# Altium schematic sheet Power_Supply.SchDoc
size A4; DocumentNumber: 1; SheetNumber: 1; SheetTotal: 3
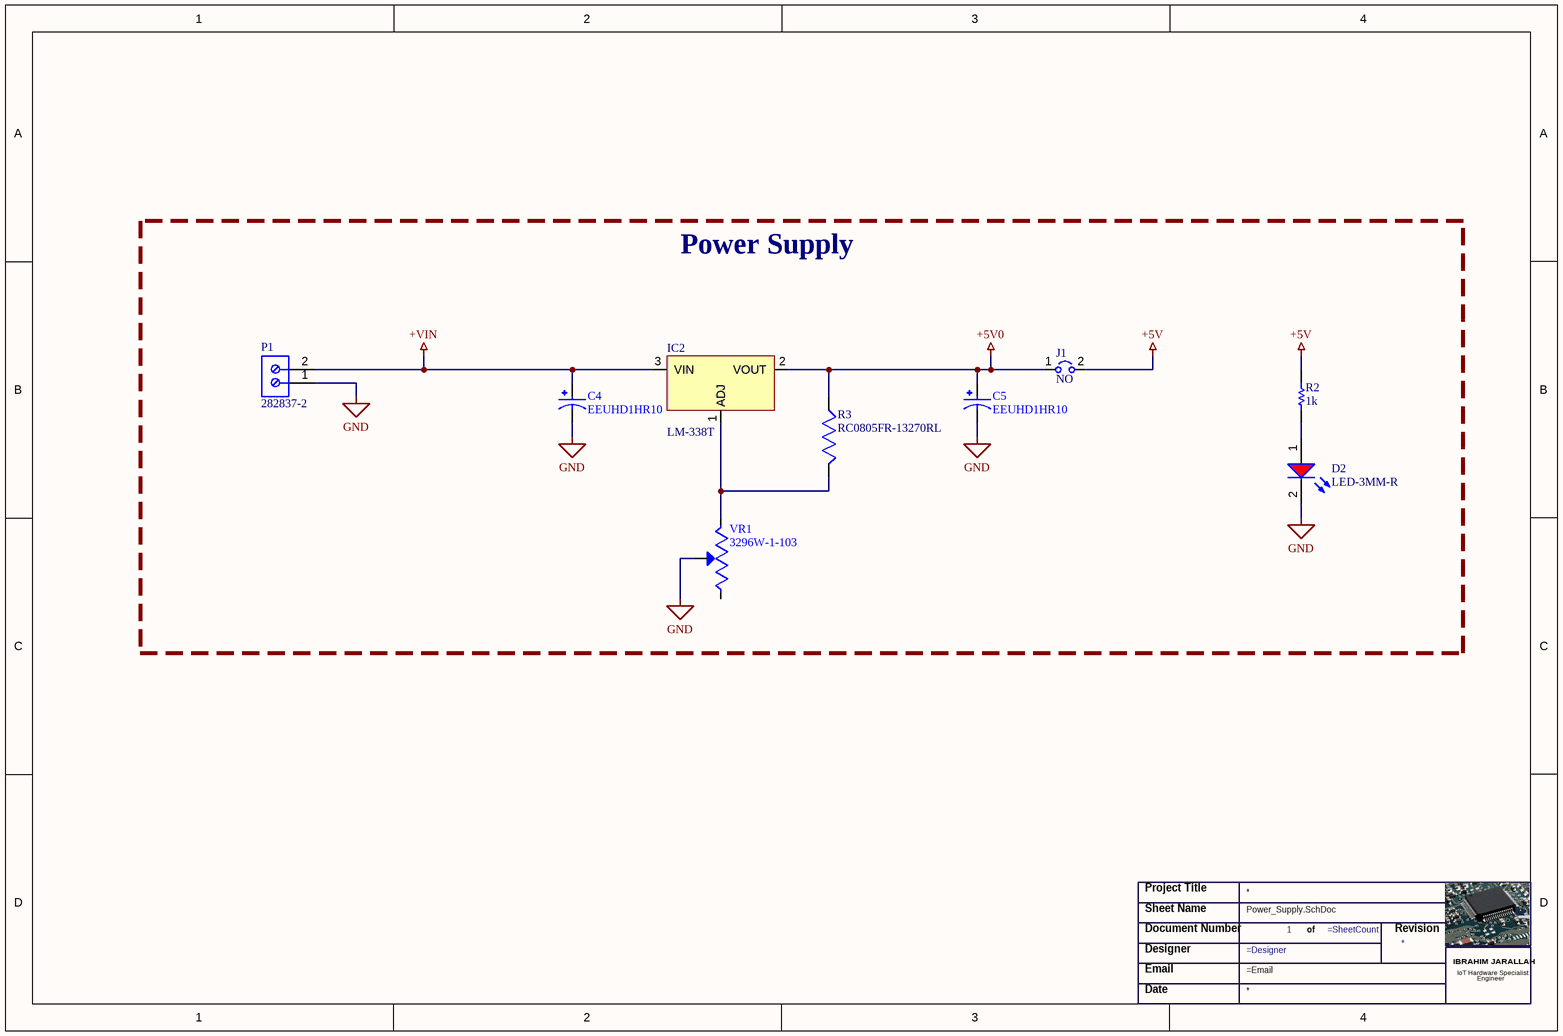
[diagram p0: Power_Supply.SchDoc]

## Parts
*  Title_block_Medium  (value not drawn)
C4  EEUHD1HR10  [CAP_ALUM_5x11_RM2.5]
C5  EEUHD1HR10  [CAP_ALUM_5x11_RM2.5]
D2  LED-3MM-R  [LED-2.54MM-R]
IC2  LM-338T  [TO-220-3]
J1  NO  [Jumper]
P1  282837-2  [TE_282837-2]
R2  1k  [RESC2013X50X30LL20T20]
R3  RC0805FR-13270RL  [RESC2012X60N]
VR1  3296W-1-103  [TRIM_3296W-1-103]

## Blocks framed on the sheet
Power Supply: C4 C5 D2 IC2 J1 P1 R2 R3 VR1

## Nets
+5V: J1.2 R2.1
+5V0: C5.1(P) IC2.2(VOUT) J1.1 R3.2
+VIN: C4.1(P) IC2.3(VIN) P1.2
GND: C4.2(N) C5.2(N) D2.2(K) P1.1 VR1.2(WIPER)
NetD2_1: D2.1(A) R2.2
NetIC2_1: IC2.1(ADJ) R3.1 VR1.3(CW)

Not connected (* = marked no-connect by the designer): VR1 1(CCW)

## Notes on the sheet
- Title:
- Formation Altium Designer Pro
- Sheet Name:
- Designer:
- Start Date:
- Page:
- Contact:
- of
- ct.formationelectronic@gmail.com
- Revision:
- End Date:
- Altium Designer Pro
- Formation
- (in symbol Title_block_Medium) Project Title; Sheet Name; Document Number; of; Revision; Designer; IBRAHIM JARALLAH; Email; IoT Hardware Specialist; Engineer; Date

## Library data of the parts
C4 C5 = EEUHD1HR10: MF: {'manufacturer': u'Panasonic'}; Package: None; Price: None; Value: *; MP: EEUHD1HR10; Availability: Unavailable
IC2 = IC_LM_338T
J1 = Jumper_NO
P1 = 282837-2: TERM BLOCK 5.08MM 2POS SIDE ENTY; MF: {'manufacturer': u'TE Connectivity'}; Package: None; Price: None; Value: *; MP: 282837-2; Availability: Unavailable
R2 = RES-0805-SMD: Value: 1k
R3 = RC0805FR-13270RL: MF: {'manufacturer': u'Yageo Corporation'}; Package: None; Price: None; Value: *; MP: RC0805FR-13270RL; Availability: Unavailable
VR1 = 3296W-1-103: MF: {'manufacturer': u'Bourns'}; Package: None; Price: None; Value: *; MP: 3296W-1-103; Availability: Unavailable